# EAGLE design mic_amp (EAGLE 7.6.0)
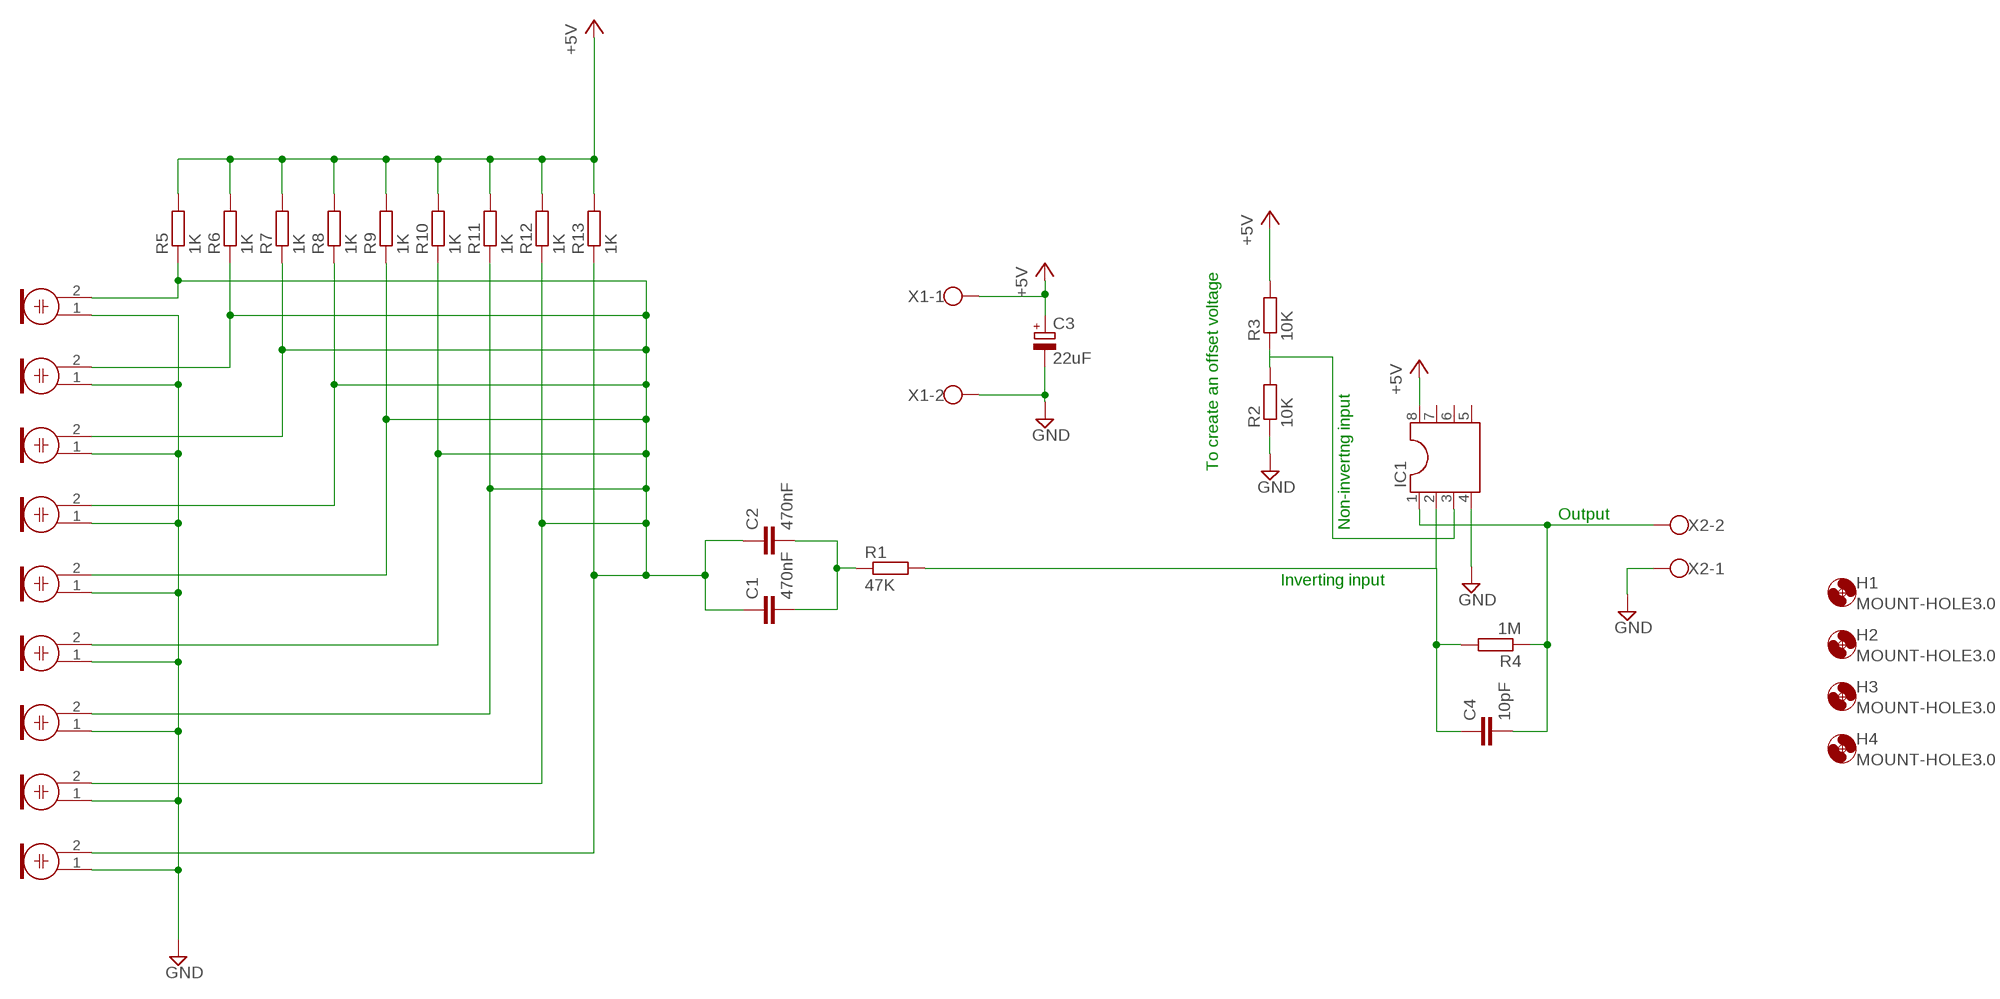
[diagram p0: schematic, sheet 1]

## Parts
C1  470nF  C-EU025-025X050  [C025-025X050]
C2  470nF  C-EU025-025X050  [C025-025X050]
C3  22uF  CPOL-EUE2-5  [E2-5]
C4  10pF  C-EU025-025X050  [C025-025X050]
H1  MOUNT-HOLE3.0  [3,0]
H2  MOUNT-HOLE3.0  [3,0]
H3  MOUNT-HOLE3.0  [3,0]
H4  MOUNT-HOLE3.0  [3,0]
IC1  DIL8S  [SOCKET-08]
M1  ELECTRET_MICROPHON-F6050AP  [F6050AP]
M2  ELECTRET_MICROPHON-F6050AP  [F6050AP]
M3  ELECTRET_MICROPHON-F6050AP  [F6050AP]
M4  ELECTRET_MICROPHON-F6050AP  [F6050AP]
M5  ELECTRET_MICROPHON-F6050AP  [F6050AP]
M6  ELECTRET_MICROPHON-F6050AP  [F6050AP]
M7  ELECTRET_MICROPHON-F6050AP  [F6050AP]
M8  ELECTRET_MICROPHON-F6050AP  [F6050AP]
M9  ELECTRET_MICROPHON-F6050AP  [F6050AP]
R1  47K  R-EU_0207/10  [0207/10]
R2  10K  R-EU_0207/10  [0207/10]
R3  10K  R-EU_0207/10  [0207/10]
R4  1M  R-EU_0207/10  [0207/10]
R5  1K  R-EU_0207/10  [0207/10]
R6  1K  R-EU_0207/10  [0207/10]
R7  1K  R-EU_0207/10  [0207/10]
R8  1K  R-EU_0207/10  [0207/10]
R9  1K  R-EU_0207/10  [0207/10]
R10  1K  R-EU_0207/10  [0207/10]
R11  1K  R-EU_0207/10  [0207/10]
R12  1K  R-EU_0207/10  [0207/10]
R13  1K  R-EU_0207/10  [0207/10]
X1  W237-102  [W237-102]
X2  W237-102  [W237-102]

## Nets
+5V: C3.+ IC1.8 R3.2 R5.2 R6.2 R7.2 R8.2 R9.2 R10.2 R11.2 R12.2 R13.2 X1.1
GND: C3.- IC1.4 M1.1 M2.1 M3.1 M4.1 M5.1 M6.1 M7.1 M8.1 M9.1 R2.1 X1.2 X2.1
N$1: C4.1 IC1.2 R4.2
N$2: C1.2 C2.2 R1.1
N$4: IC1.3 R2.2 R3.1
N$5: C1.1 C2.1 M1.2 M2.2 M3.2 M4.2 M5.2 M6.2 M7.2 M8.2 M9.2 R5.1 R6.1 R7.1 R8.1 R9.1 R10.1 R11.1 R12.1 R13.1
N$7: C4.2 IC1.1 R4.1 X2.2
Unconnected: IC1.5 IC1.6 IC1.7 R1.2

## Notes on the sheet
- To create an offset voltage
- Output
- Non-invertng input
- Inverting input

## Library data of the parts
C1 C2 C4 = rcl:C-EU: CAPACITOR, European symbol
C3 = rcl:CPOL-EU: POLARIZED CAPACITOR, European symbol
H1-H4 = holes:MOUNT-HOLE: MOUNTING HOLE with drill center marker
IC1 = ic-package:DIL8: Dual In Line / Socket
M1-M9 = microphon:ELECTRET_MICROPHON-: Electret Condenser Microphone
R1-R13 = resistor:R-EU_: RESISTOR, European symbol
X1 X2 = con-wago-500:W237-102: WAGO SCREW CLAMP; MPN: 237-102; OC_FARNELL: unknown; OC_NEWARK: 70K9898

## Board
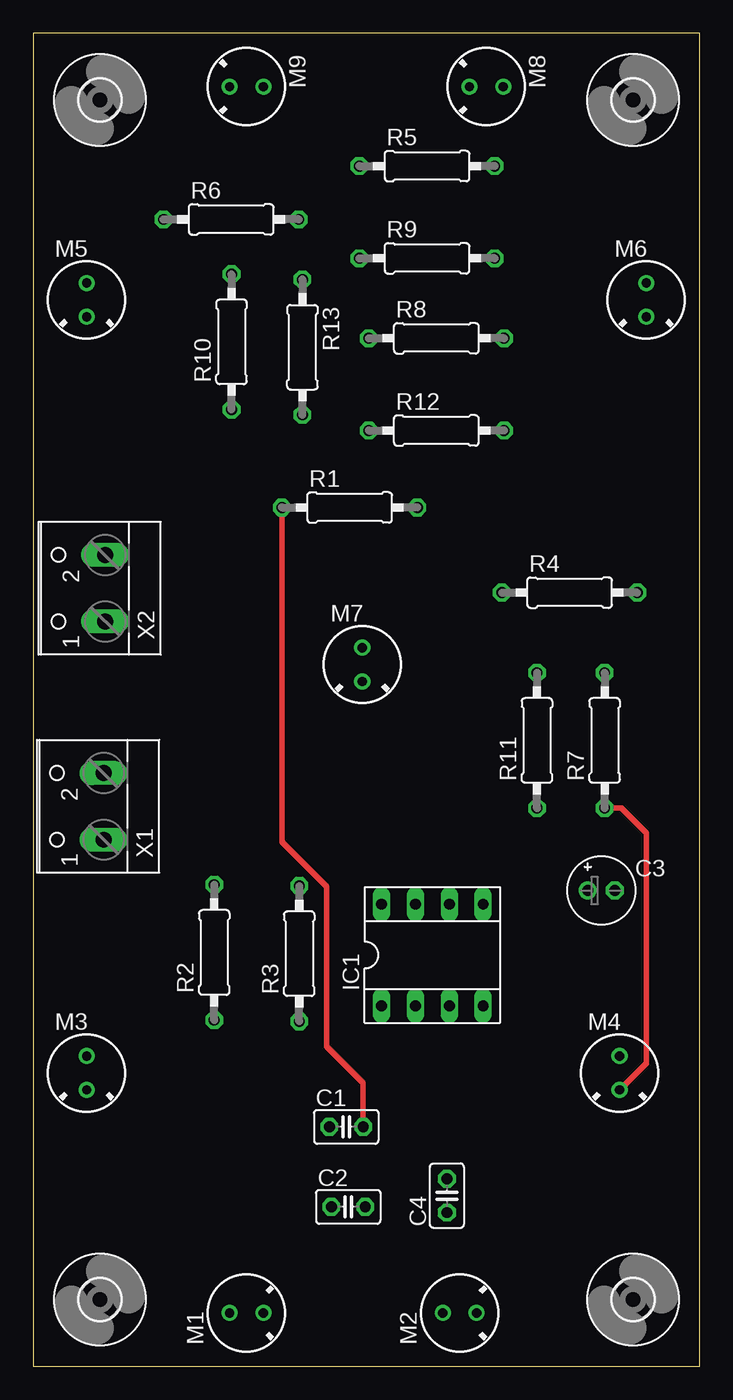
[diagram p1: board, top side]
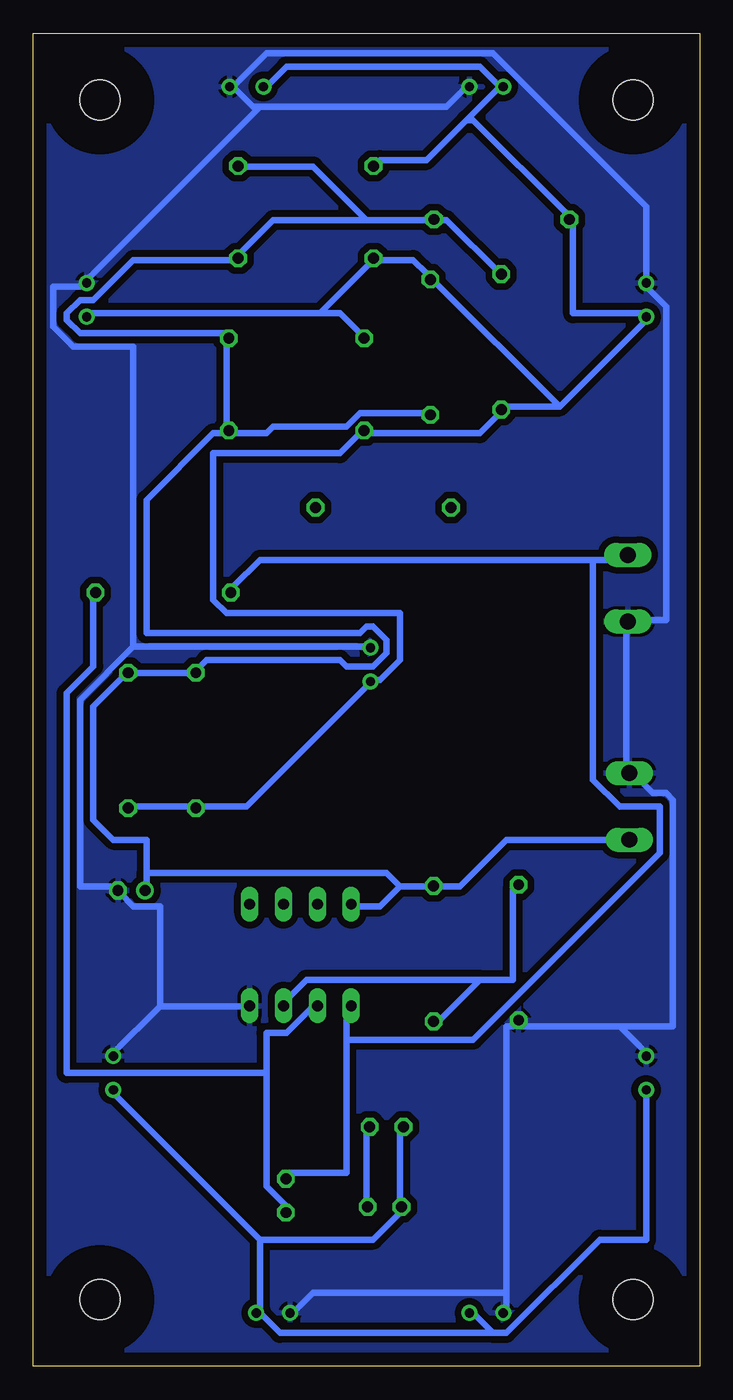
[diagram p2: board, bottom side, seen from below]

Size 50 x 100 mm. Coordinates in mm from the lower left corner, seen from the top.
Outline: 0,0 50,0 50,100 0,100 0,0
Copper layers (1*16): Top 0.035mm / dielectric 1.5mm / Bottom 0.035mm
Design rules "default *": minimum track width 0.5mm, minimum drill 24mil, track to track 0.5mm, track to pad 8mil, pad to pad 8mil, via to via 8mil, smd to smd 8mil, copper to edge 40mil, drill to drill 8mil, minimum pad ring 10mil, minimum via ring 8mil, stop-mask expansion 4mil, vias tented up to drill 0mil, thermal gap 10mil

### Footprints (pad centres in the part's own frame; a part is rotated, then mirrored left to right if it is on the bottom)
C025-025X050 = drill 0.813 octagon: 1 -1.27,0; 2 1.27,0
E2-5 = drill 0.813 pad 1.27: + -1.016,0 | drill 0.813 pad 1.27 octagon: - 1.016,0
3,0 = hole 3: 0,0
SOCKET-08 = drill 0.813 long: 1 -3.81,-3.81; 2 -1.27,-3.81; 3 1.27,-3.81; 4 3.81,-3.81; 5 3.81,3.81; 6 1.27,3.81; 7 -1.27,3.81; 8 -3.81,3.81
F6050AP = drill 0.7 pad 1.2: 1 0,1.27; 2 0,-1.27
0207/10 = drill 0.813 octagon: 1 -5.08,0; 2 5.08,0
W237-102 = drill 1.194 long: 1 -2.5,-1.27; 2 2.5,-1.27

### Placement (x,y rotation side)
C1  23.49,17.96 0 top
C2  23.64,11.96 0 top
C3  42.63,35.69 0 top
C4  31.04,12.79 90 top
H1  5,5 0 top
H2  45,5 0 top
H3  5,95 0 top
H4  45,95 0 top
IC1  29.95,30.85 0 top
M1  16,4 90 top
M2  32,4 90 top
M3  4,22 0 top
M4  44,22 0 top
M5  4,80 0 top
M6  46,80 0 top
M7  24.69,52.64 0 top
M8  34,96 270 top
M9  16,96 270 top
R1  23.74,64.42 0 top
R2  13.58,31.04 90 top
R3  19.96,30.95 90 top
R4  40.25,58.04 0 top
R5  29.55,90.04 0 top
R6  14.85,86.04 0 top
R7  42.88,46.95 90 top
R8  30.25,77.12 0 top
R9  29.55,83.12 0 top
R10  14.88,76.85 90 top
R11  37.8,46.95 90 top
R12  30.25,70.2 0 top
R13  20.2,76.45 270 top
X1  4,42 90 top
X2  4.11,58.37 90 top

### Tracks (layer width: path | path; a pad name or v marks a point on that pad's centre or on a via)
+5V
  Bottom 0.5: R13.2 20.5,71.5 25.5,71.5 26.5,70.5 32,70.5 32.5,70 35,70 R12.2 | R12.2 35.5,70.5 35.5,77 R8.2 35.5,77.5 46.5,77.5 47.5,78.5 47.5,79 46.5,80 45.5,80 42.5,83 35,83 R9.2 34.5,83.5 32,86 25,86 | 25,86 29,90 34.5,90 R5.2 | 25,86 20,86 R6.2 19.5,86 19,86 15,82 R10.2 | 41.5,37 41.5,39.5 44,39.5 45.5,41 45.5,49.5 43,52 R7.2 42.5,52 38,52 R11.2 37.5,52.5 37,53 27,53 26.5,52.5 24.5,52.5 23.5,53.5 23.5,54.5 24.5,55.5 25,55.5 25.5,55 41.5,55 41.5,65 36.5,70 35.5,70 R12.2 | 41.5,37 41.5,36 C3.+ | 22.5,36 20,36 R3.2 19.5,36 18,36 14.5,39.5 X1.1 | 22.5,36 24,34.5 26,34.5 IC1.8 | 41.5,37 23.5,37 22.5,36
GND
  Bottom 0.5: 40.5,27 44,23.5 M4.1 | 40.5,27 34,27 IC1.4 | 42.5,54 25,54 M7.1 | 42.5,54 46.5,50 46.5,36 44,36 C3.- 43.5,35.5 42.5,34.5 40.5,34.5 40.5,27 | 33,94.5 33.5,94.5 35,96 | 33,94.5 19,94.5 17.5,96 M9.1 | 33,94.5 46,81.5 M6.1 46,81 48.5,81 48.5,78 47,76.5 42.5,76.5 42.5,54 | 14.5,5.5 14.5,25.5 14,25.5 R2.1 13.5,25.5 6,25.5 | 14.5,5.5 14.5,4 M1.1 | 6,25.5 4,23.5 M3.1 | 14.5,5.5 29,5.5 30.5,4 M2.1 | 6,25.5 2,25.5 2,42.5 2.5,43 3.5,43 5,44.5 X1.2 5.5,44.5 5.5,55.5 X2.1 5,56 2.5,56 2.5,79.5 4,81 M5.1 4,87 15.5,98.5 32.5,98.5 35,96 | 35,96 M8.1
  pour Bottom: 0,100 50,100 50,0 0,0
N$1
  Bottom 0.5: 32.5,22 32.5,25 31,25 29,27 IC1.2 | 32.5,22 32.5,13.5 31,12 C4.1 | 32.5,22 47.5,22 47.5,50.5 45.5,52.5 45.5,58 R4.2
N$2
  Top 0.406: R1.1 18.66,39.34 22,36 22,24 24.76,21.24 C1.2
  Bottom 0.5: C2.2 25,12 25,17.5 C1.2
N$4
  Bottom 0.5: 16.5,29 14,29 14,36 R2.2 | 16.5,29 19.5,26 R3.1 | 16.5,29 29.5,29 31,27.5 IC1.3
N$5
  Top 0.406: R7.1 44.13,41.87 46,40 46,22.73 M4.2
  Bottom 0.5: 17.5,93.5 20.5,90.5 24,90.5 R5.1 | 17.5,93.5 15,96 | 15,96 16.5,97.5 31,97.5 32.5,96 M8.2 | 15,96 M9.2 | 17.5,93.5 17,93.5 10,86.5 R6.1 9.5,86 9.5,79 4,79 M5.2 4,78.5 10.5,72 | 28.5,79 27,79 25.5,77.5 R8.1 | 28.5,79 46,79 M6.2 | 28.5,79 24.5,83 R9.1 24,83 21.5,83 20.5,82 R13.1 20,81.5 10.5,72 | R7.1 42.5,42 38,42 R11.1 37.5,42 34,42 25,51 M7.2 24.5,51.5 24,51.5 22.5,53 22.5,56.5 35.5,56.5 36.5,57.5 36.5,68.5 27,68.5 25.5,70 R12.1 25,70 16.5,70 15,71.5 R10.1 14.5,72 10.5,72 | C1.1 22.5,17.5 22.5,12 C2.1 22.5,11.5 24.5,9.5 33,9.5 | M3.2 4,9.5 7.5,9.5 14.5,2.5 15.5,2.5 | 15.5,2.5 17,4 M1.2 | 33,4 31.5,2.5 15.5,2.5 | 33,9.5 44,20.5 M4.2 | 33,4 33,9.5 | 33,4 M2.2
N$7
  Bottom 0.5: 26.5,24.5 26.5,14.5 31,14.5 C4.2 | 26.5,24.5 26.5,27 IC1.1 | 8,60.5 5.5,60.5 X2.2 | 8,60.5 33,60.5 35,58.5 R4.1 | 26.5,24.5 17,24.5 3,38.5 3,42 6,42 8,44 8,60.5